# EAGLE design Qwiic RFID - IDXXLA (EAGLE 9.1.0)
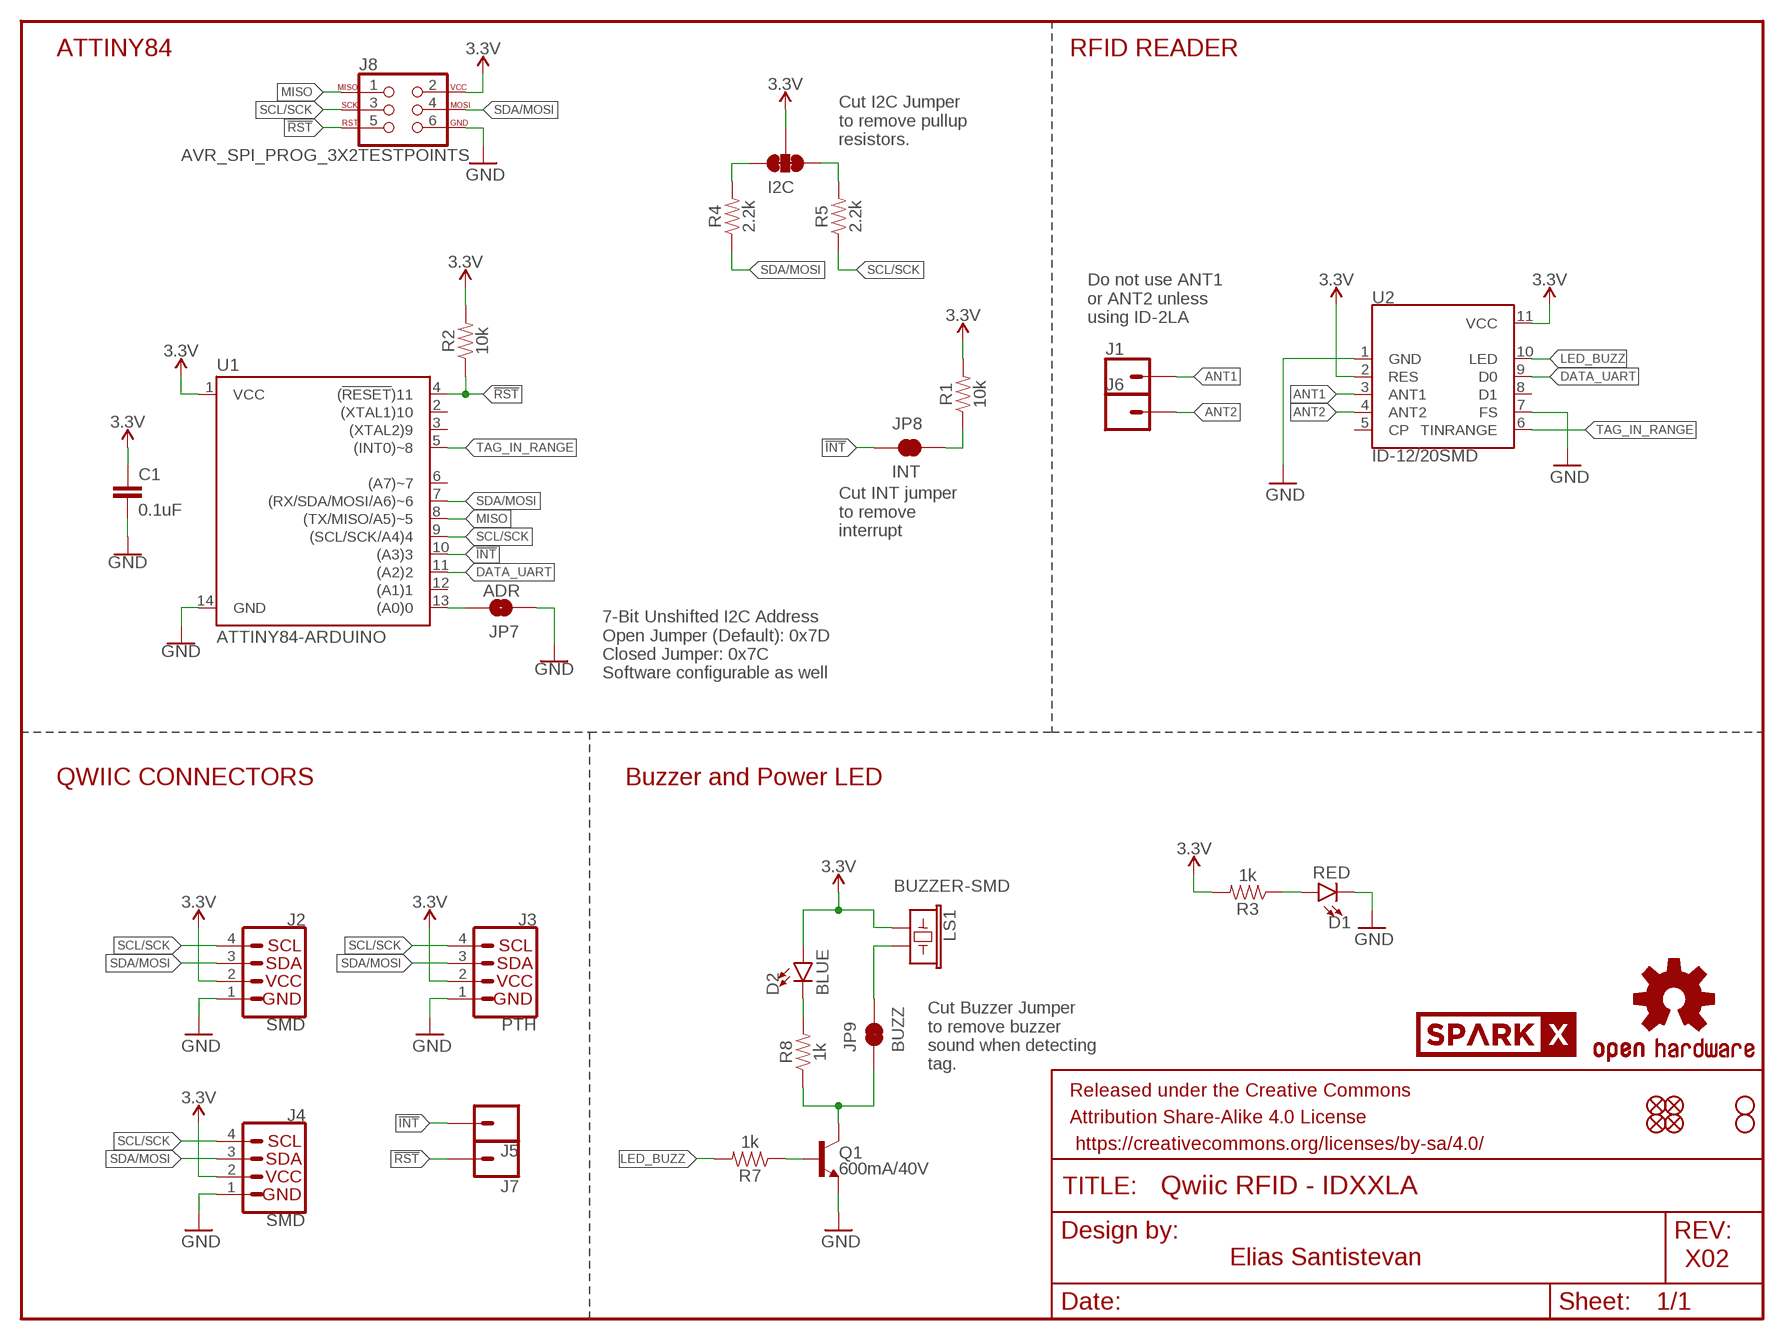
[diagram p0: schematic, sheet 1]

## Parts
C1  0.1uF  0.1UF-0603-25V-(+80/-20%)  [0603]
D1  RED  LED-RED0603  [LED-0603]
D2  BLUE  LED-BLUE0603  [LED-0603]
FRAME1  FRAME-LETTER  [CREATIVE_COMMONS]
I2C  JUMPER-SMT_3_2-NC_TRACE_SILK  [SMT-JUMPER_3_2-NC_TRACE_SILK]
J1  CONN_01PTH_NO_SILK_YES_STOP  [1X01_NO_SILK]
J2  SMD  I2C_STANDARDJS-1MM  [1X04_1MM_RA]
J3  PTH  I2C_STANDARD_NO_SILK  [1X04_NO_SILK]
J4  SMD  I2C_STANDARDJS-1MM  [1X04_1MM_RA]
J5  CONN_01PTH_NO_SILK_YES_STOP  [1X01_NO_SILK]
J6  CONN_01PTH_NO_SILK_YES_STOP  [1X01_NO_SILK]
J7  CONN_01PTH_NO_SILK_YES_STOP  [1X01_NO_SILK]
J8  AVR_SPI_PROG_3X2TESTPOINTS  [2X3_TEST_POINTS]
JP1  FIDUCIALUFIDUCIAL  [MICRO-FIDUCIAL]
JP2  FIDUCIALUFIDUCIAL  [MICRO-FIDUCIAL]
JP3  STAND-OFF  [STAND-OFF]
JP4  STAND-OFF  [STAND-OFF]
JP5  FIDUCIALUFIDUCIAL  [MICRO-FIDUCIAL]
JP6  FIDUCIALUFIDUCIAL  [MICRO-FIDUCIAL]
JP7  ADR  JUMPER-SMT_2_NO_SILK  [SMT-JUMPER_2_NO_SILK]
JP8  INT  JUMPER-SMT_2_NC_TRACE_SILK  [SMT-JUMPER_2_NC_TRACE_SILK]
JP9  BUZZ  JUMPER-SMT_2_NC_TRACE_SILK  [SMT-JUMPER_2_NC_TRACE_SILK]
LOGO1  OSHW-LOGOMINI  [OSHW-LOGO-MINI]
LS1  BUZZER-SMD  [BUZZER-CCV]
Q1  600mA/40V  TRANS_NPN-MMBT2222AL  [SOT23-3]
R1  10k  10KOHM-0603-1/10W-1%  [0603]
R2  10k  10KOHM-0603-1/10W-1%  [0603]
R3  1k  1KOHM-0603-1/10W-1%  [0603]
R4  2.2k  2.2KOHM-0603-1/10W-1%  [0603]
R5  2.2k  2.2KOHM-0603-1/10W-1%  [0603]
R7  1k  1KOHM-0603-1/10W-1%  [0603]
R8  1k  1KOHM-0603-1/10W-1%  [0603]
U1  ATTINY84-ARDUINO  [SO14]
U2  ID-12/20SMD  [ID-12_SMD]
U$4  SPARKX-LOGO3  [SPARKX-SMALL]

## Nets
3.3V: C1.1 D2.A I2C.2 J2.2(VCC) J3.2(VCC) J4.2(VCC) J8.2 LS1.+ R1.2 R2.2 R3.2 U1.1(VCC) U2.2(RES) U2.11(VCC)
!INT: J5.1 JP8.1 U1.10((A3)3)
!RST: J7.1 J8.5 R2.1 U1.4((!RESET!)11)
ANT1: J1.1 U2.3(ANT1)
ANT2: J6.1 U2.4(ANT2)
DATA_UART: U1.11((A2)2) U2.9(D0)
GND: C1.2 D1.C J2.1(GND) J3.1(GND) J4.1(GND) J8.6 JP7.1 Q1.2(E) U1.14(GND) U2.1(GND) U2.7(FS)
LED_BUZZ: R7.2 U2.10(LED)
MISO: J8.1 U1.8((TX/MISO/A5)~5)
N$1: I2C.1 R5.2
N$2: I2C.3 R4.2
N$3: D1.A R3.1
N$4: JP8.2 R1.1
N$5: D2.C R8.2
N$6: JP7.2 U1.13((A0)0)
N$7: Q1.1(B) R7.1
N$8: JP9.1 Q1.3(C) R8.1
N$9: JP9.2 LS1.-
SCL/SCK: J2.4(SCL) J3.4(SCL) J4.4(SCL) J8.3 R5.1 U1.9((SCL/SCK/A4)4)
SDA/MOSI: J2.3(SDA) J3.3(SDA) J4.3(SDA) J8.4 R4.1 U1.7((RX/SDA/MOSI/A6)~6)
TAG_IN_RANGE: U1.5((INT0)~8) U2.6(TINRANGE)
Unconnected: U1.2((XTAL1)10) U1.3((XTAL2)9) U1.6((A7)~7) U1.12((A1)1) U2.5(CP) U2.8(D1)

## Notes on the sheet
- ATTINY84 | RFID READER
- Cut I2C Jumper
  to remove pullup 
  resistors.
- Do not use ANT1 
  or ANT2 unless 
  using ID-2LA
- Cut INT jumper
  to remove 
  interrupt
- 7-Bit Unshifted I2C Address
  Open Jumper (Default): 0x7D
  Closed Jumper: 0x7C
  Software configurable as well
- QWIIC CONNECTORS | Buzzer and Power LED
- Cut Buzzer Jumper 
  to remove buzzer
  sound when detecting 
  tag.
- Elias Santistevan | X02

## Library data of the parts
C1 = SparkFun-Capacitors:0.1UF: 0.1µF ceramic capacitors A capacitor is a passive two-terminal electrical component used to store electrical energy temporarily in an electric field.; PROD_ID: CAP-00810
D1 = SparkFun-LED:LED-RED: Red SMD LED Used in manufacturing of most products at SparkFun Packages: 0603 - SMD 0603 package [Product Link] <http://docs.avagotech.com/docs/AV02-0551EN> 0603 SMART - SMD 0603 SMART package ( more efficient and expensive)[Product Link] <http://www.osram-os.com/Graphics/XPic2/00077099_0.pdf> 1206 - SMD1206 package [Product Link] <https://www.sparkfun.com/datasheets/DevTools/LilyPad/Q150OVS4.pdff> SparkFun Products: Pro Mini 328 -5V <https://www.sparkfun.com/products/821> RedBoard <https://www.sparkfun.com/products/12757> IOIO-OTG <https://www.sparkfun.com/products/13613>; PROD_ID: DIO-00819
D2 = SparkFun-LED:LED-BLUE: Blue SMD LED Used in manufacturing of various products at SparkFun Packages: 0603 - SMD 0603 package [Product Link] <http://www.digikey.com/product-detail/en/SMLE12BC7TT86/511-1589-2-ND/1641808> 1206 - SMD1206 package [Product Link] <http://www.digikey.com/product-detail/en/lite-on-inc/LTST-C150TBKT/160-1643-1-ND/573584> SparkFun Products: ESP8266 Thing-Dev Board <https://www.sparkfun.com/products/13711> RedBoard <https://www.sparkfun.com/products/12757>; PROD_ID: DIO-08575
FRAME1 = SparkFun-Aesthetics:FRAME-LETTER: Schematic Frame - Letter Standard 8.5x11 US Letter frame
I2C = SparkFun-Jumpers:JUMPER-SMT_3_2-NC_TRACE: Normally closed trace jumper (2 of 2 connections) This jumper has a trace between all three pads so they are normally closed (NC). Use a razor knife to open the connection(s). For best results follow the IPC guidelines for cutting traces: Cutout at least 0.063 mm (0.005 in). Remove all loose material to clean up the cut area. Seal the cut with an approved epoxy. Reapply solder to reclose the connection(s).
J1 J5-J7 = SparkFun-Connectors:CONN_01: Single connection point. Often used as Generic Header-pin footprint for 0.1 inch spaced/style header connections On any of the 0.1 inch spaced packages, you can populate with these: Break Away Headers - Straight <https://www.sparkfun.com/products/116> (PRT-00116) Break Away Male Headers - Right Angle <https://www.sparkfun.com/products/553> (PRT-00553) Female Headers <https://www.sparkfun.com/products/115> (PRT-00115) Break Away Headers - Machine Pin <https://www.sparkfun.com/products/117> (PRT-00117) Break Away Female Headers - Swiss Machine Pin <https://www.sparkfun.com/products/743> (PRT-00743) This device is also useful as a general connection point to wire up your design to another part of your project. Our various solder wires solder well into these plated through hole pads. Hook-Up Wire - Assortment (Stranded, 22 AWG) <https://www.sparkfun.com/products/11375> (PRT-11375) Hook-Up Wire - Assortment (Solid Core, 22 AWG) <https://www.sparkfun.com/products/11367> (PRT-11367) View the entire wire category on our website here <https://www.sparkfun.com/categories/141> Special notes: SMTSO-256-ET is a "flush mount" nut for a 4-40 screw. We mostly use this on specialty testbeds; it is a nice way to connect hardware to your PCB at an adjustable hieght. Also note, the SNAP packages are for using a snappable style connector. We sell a baggie of snaps and they are also used on two LilyPad designs: Snap Assortment - 30 pack (male and female) <https://www.sparkfun.com/products/11347> (DEV-11347) LilyPad Arduino SimpleSnap <https://www.sparkfun.com/products/10941> (DEV-10941) LilyPad SimpleSnap Protoboard <https://www.sparkfun.com/products/10940> (DEV-10940)
J2-J4 = SparkX:I2C_STANDARD: SparkFun I2C Standard Pinout Header SparkFun has standardized on a pinout for all I2C based sensor breakouts. This pinout allows I2C boards to be plugged directly into the headers on Arduino Uno compatible boards, and to be daisy chained easily. Example SparkFun Products: SparkFun Atmospheric Sensor Breakout - BME280 <https://www.sparkfun.com/products/13676> SparkFun Altitude/Pressure Sensor Breakout - MPL3115A2 <https://www.sparkfun.com/products/11084> SparkFun TOF Range Finder Sensor - VL6180 <https://www.sparkfun.com/products/12785>
J8 = SparkFun-Connectors:AVR_SPI_PROG_3X2: AVR ISP 6 Pin This is the reduced ISP connector for AVR programming. Common on Arduino. This footprint will take up less PCB space and can be used with a 10-pin to 6-pin adapter such as SKU: BOB-08508 **Special note about "TEST_POINT" package. The stop mask is on the top side, so if you want your programming test points to be on the bottom of your board, make sure to place this package on the bottom side of the board. This also ensure that the orientation to program from the bottom side will be correct. SparkFun Products: SparkFun ISP Pogo Adapter <https://www.sparkfun.com/products/11591> - NS Tiny AVR Programmer <https://www.sparkfun.com/products/11801> -PTH
JP1 JP2 JP5 JP6 = SparkFun:FIDUCIAL: Fiducial Alignment Points Various fiducial points for machine vision alignment.
JP3 JP4 = SparkFun:STAND-OFF: Stand Off This is the mechanical footprint for a #4 phillips button head screw. Use the keepout ring to avoid running the screw head into surrounding components. SKU : PRT-00447
JP7 = SparkFun-Jumpers:JUMPER-SMT_2_NO: Normally open jumper This jumper has two pads in close proximity to each other. Apply solder to close the connection. Round pads are easier to solder for beginners, but are a lot larger. SparkFun Product that uses the round pads: SparkFun EL Sequencer <https://www.sparkfun.com/products/12781>
JP8 JP9 = SparkFun-Jumpers:JUMPER-SMT_2_NC_TRACE: Normally closed trace jumper This jumper has a trace between two pads so it's normally closed (NC). Use a razor knife to open the connection. For best results follow the IPC guidelines for cutting traces: Cutout at least 0.063 mm (0.005 in). Remove all loose material to clean up the cut area. Seal the cut with an approved epoxy. Reapply solder to reclose the connection.
LOGO1 = SparkFun-Aesthetics:OSHW-LOGO: Open-Source Hardware (OSHW) Logo This logo indicates the piece of hardware it is found on incorporates a OSHW license and/or adheres to the definition of open source hardware found here: http://freedomdefined.org/OSHW
LS1 = SparkFun-Electromechanical:BUZZER: Buzzer Small round buzzers that operate around the audible 2kHz range. You can use these as speakers to create simple music or user interfaces. Variant Overview: PTH - Mini Speaker - PC Mount 12mm 2.048kHz <https://www.sparkfun.com/products/7950> PTH_KIT - Mini Speaker - PC Mount 12mm 2.048kHz <https://www.sparkfun.com/products/7950> KIT simplifies soldering by adding stop mask to one side of the pads. PTH_NO_SILK - Mini Speaker - PC Mount 12mm 2.048kHz <https://www.sparkfun.com/products/7950> No silkscreen indicator of buzzer outline. PTH_KIT_NO_SILK - Mini Speaker - PC Mount 12mm 2.048kHz <https://www.sparkfun.com/products/7950> KIT package w/o silkscreen SMD - Buzzer Audio Magnetic (CCV-084B16) SMD buzzer used on, e.g. the LilyPad Buzzer <https://www.sparkfun.com/products/8463> and RFID USB Reader <https://www.sparkfun.com/products/9963>. SMD_KIT - Buzzer Audio Magnetic (CCV-084B16) SMD Buzzer with elongated pins to make soldering easier. Used on the SparkFun Simon Says - Surface Mount Soldering Kit <https://www.sparkfun.com/products/10935>.; PROD_ID: COMP-08568
Q1 = SparkFun-DiscreteSemi:TRANS_NPN: NPN transistor Current controlled devices typically used to amplify current or used as a switch. BC547 - COM-08928 <http://www.sparkfun.com/products/8928> (TO-92 45V 100mA) (1.Collector 2.Base 3.Emitter) 2N3904 - COM-00521 <http://www.sparkfun.com/products/521> (TO-92 40V 200mA) (1.Emitter 2.Base 3.Collector) P2N2222A - COM-12852 <http://www.sparkfun.com/products/12852> (TO-92 40V 600mA) (1.Collector 2.Base 3.Emitter); PROD_ID: TRANS-08049
R1 R2 = SparkFun-Resistors:10KOHM: 10kΩ resistor A resistor is a passive two-terminal electrical component that implements electrical resistance as a circuit element. Resistors act to reduce current flow, and, at the same time, act to lower voltage levels within circuits. - Wikipedia; PROD_ID: RES-00824
R3 R7 R8 = SparkFun-Resistors:1KOHM: 1kΩ resistor A resistor is a passive two-terminal electrical component that implements electrical resistance as a circuit element. Resistors act to reduce current flow, and, at the same time, act to lower voltage levels within circuits. - Wikipedia; PROD_ID: RES-07856
R4 R5 = SparkFun-Resistors:2.2KOHM: 2.2kΩ resistor A resistor is a passive two-terminal electrical component that implements electrical resistance as a circuit element. Resistors act to reduce current flow, and, at the same time, act to lower voltage levels within circuits. - Wikipedia; PROD_ID: RES-08272
U1 = SparkFun-IC-Microcontroller:ATTINY84-ARDUINO; PROD_ID: IC-11285
U2 = SparkFun-RF:ID-12/20: ID Innovations 125kHz RFID Reader (ID2, ID3, ID12, and ID20) The IDS, ID3, ID12, and ID20 are very simple to use RFID reader modules. Power the module, hold up a 125kHz card, and get a serial string output containing the unique ID of the card. SparkFun Products RFID Reader ID-3LA (125 kHz) <https://www.sparkfun.com/products/11862> (SEN-11862) RFID Reader ID-12LA (125 kHz) <https://www.sparkfun.com/products/11827> (SEN-11827) RFID Reader ID-20LA (125 kHz) <https://www.sparkfun.com/products/11828> (SEN-11828) SparkFun RFID USB Reader <https://www.sparkfun.com/products/9963> (SEN-9963); PROD_ID: CONN-09345, CONN-09344
U$4 = SparkX:SPARKX-LOGO

## Net classes
1 power: width 0.203 mm

## Board
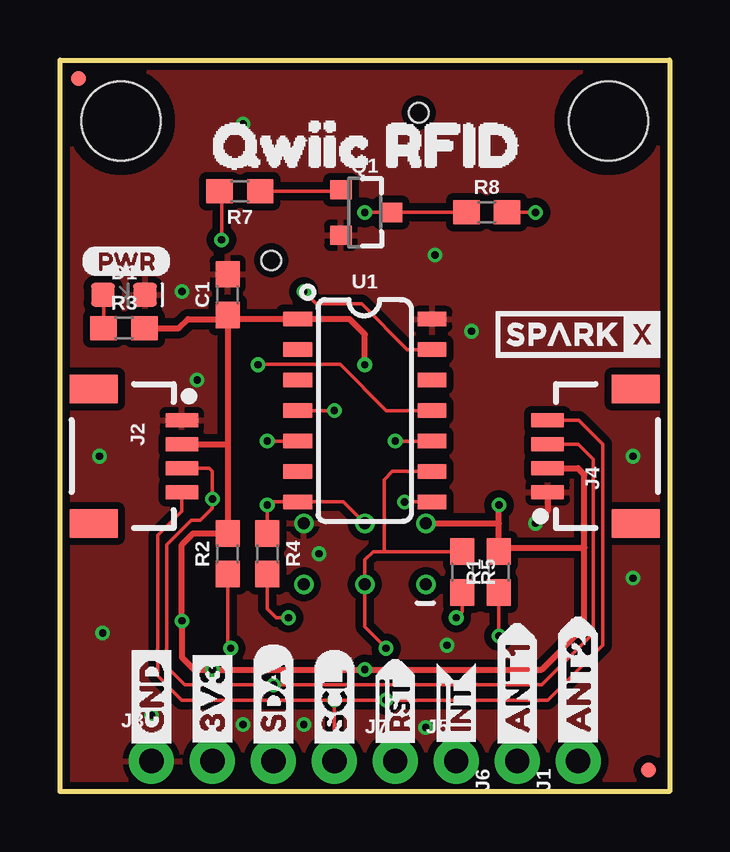
[diagram p1: board, top side]
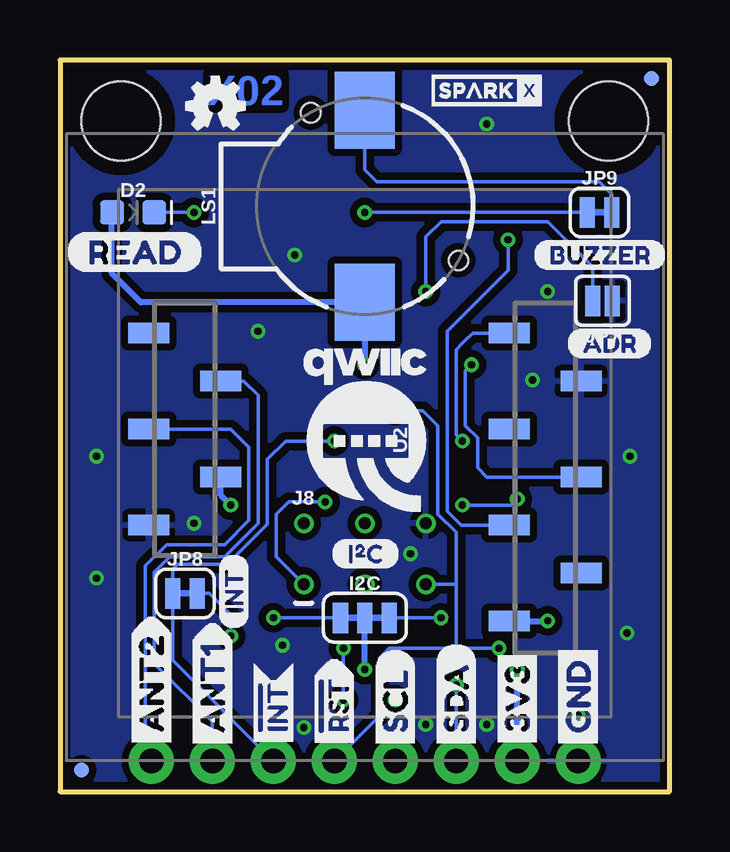
[diagram p2: board, bottom side, seen from below]

Size 25.4 x 30.48 mm. Coordinates in mm from the lower left corner, seen from the top.
Outline: 0,0 0,30.48 25.4,30.48 25.4,0 0,0
Copper layers (1*16): Top 0.035mm / dielectric 1.5mm / Bottom 0.035mm
Design rules "SparkFun-2-layer-PCBWay-LIMIT": minimum track width 6mil, minimum drill 0.3mm, track to track 6mil, track to pad 6mil, pad to pad 6mil, via to via 6mil, smd to smd 6mil, copper to edge 6mil, drill to drill 6mil, minimum pad ring 6mil, minimum via ring 6mil, stop-mask expansion 4mil, vias tented up to drill 25mil, thermal gap 10mil

### Footprints (pad centres in the part's own frame; a part is rotated, then mirrored left to right if it is on the bottom)
0603 = smd 1.1 x 1: 1 -0.85,0; 2 0.85,0
LED-0603 = smd 1 x 1: A -0.877,0; C 0.877,0
SMT-JUMPER_3_2-NC_TRACE_SILK = smd 0.635 x 1.27: 1 -1.016,0; 2 0,0; 3 1.016,0
1X01_NO_SILK = drill 1.016 pad 1.88: 1 0,0
1X04_1MM_RA = smd 0.6 x 1.35: 1 -1.5,0; 2 -0.5,0; 3 0.5,0; 4 1.5,0 | smd 1.2 x 2: NC1 2.8,-3.675; NC2 -2.8,-3.675
1X04_NO_SILK = drill 1.016 pad 1.88: 1 0,0; 2 2.54,0; 3 5.08,0; 4 7.62,0
2X3_TEST_POINTS = drill 0.508: 1 -2.54,-1.27; 2 -2.54,1.27; 3 0,-1.27; 4 0,1.27; 5 2.54,-1.27; 6 2.54,1.27
MICRO-FIDUCIAL = smd 0.635 x 0.635: 1 0,0
STAND-OFF = hole 3.302: 0,0
SMT-JUMPER_2_NO_SILK = smd 0.635 x 1.27: 1 -0.406,0; 2 0.406,0
SMT-JUMPER_2_NC_TRACE_SILK = smd 0.635 x 1.27: 1 -0.508,0; 2 0.508,0
BUZZER-CCV = smd 3.2 x 2.5: + 4,0; - -4,0 | hole 0.8: -3.9,-2.25; 2.25,3.9
SOT23-3 = smd 0.8 x 0.9: 1 -0.95,-1; 2 0.95,-1; 3 0,1.1
SO14 = smd 0.6 x 1.2: 1 -3.175,-2.8; 2 -1.905,-2.8; 3 -0.635,-2.8; 4 0.635,-2.8; 5 1.905,-2.8; 6 3.175,-2.8; 7 4.445,-2.8; 8 4.445,2.8; 9 3.175,2.8; 10 1.905,2.8; 11 0.635,2.8; 12 -0.635,2.8; 13 -1.905,2.8; 14 -3.175,2.8
ID-12_SMD = smd 0.85 x 1.7: 1 2.993,-8.998; 2 0.993,-5.998; 3 -1.007,-8.998; 4 -3.007,-5.998; 5 -5.007,-8.998; 6 -5.007,6.013; 7 -3.007,9.013; 8 -1.007,6.013; 9 0.993,9.013; 10 2.993,6.013; 11 6.993,6.013; NC 4.993,9.013

### Placement (x,y rotation side)
C1  6.99,20.7 90 top
D1  2.67,20.7 0 top
D2  22.35,24.13 0 bottom
FRAME1  -8.89,-10.16 0 top  (outside the outline)
I2C  12.7,7.24 0 bottom
J1  21.59,1.27 90 top
J2  5.08,13.97 270 top
J3  3.81,1.27 0 top
J4  20.32,13.97 90 top
J5  16.51,1.27 0 top
J6  19.05,1.27 90 top
J7  13.97,1.27 0 top
J8  12.7,9.91 0 bottom
JP1  0.76,29.72 0 bottom
JP2  24.51,0.89 0 top
JP3  2.54,27.94 0 top
JP4  22.86,27.94 0 top
JP5  24.51,0.89 0 bottom
JP6  0.76,29.72 0 top
JP7  2.79,20.45 180 bottom
JP8  20.19,8.26 0 bottom
JP9  2.92,24.13 0 bottom
LOGO1  18.92,28.57 0 bottom
LS1  12.7,24.38 270 bottom
Q1  12.7,24.13 270 top
R1  18.29,9.14 90 top
R2  6.99,9.91 90 top
R3  2.67,19.3 0 top
R4  8.64,9.91 270 top
R5  16.76,9.14 270 top
R7  7.49,25.02 180 top
R8  17.78,24.13 0 top
U1  12.7,16.51 270 top
U2  12.7,14.1 270 bottom
U$1  [SPARKX-TINY]  7.62,29.21 0 bottom
U$2  [I_SUPER2_C-()-03]  14.1,9.91 0 bottom
U$3  [ANT20]  21.59,1.52 90 bottom
U$4  21.59,19.05 0 top
U$5  [RST#-[>]  13.97,1.4 90 top
U$6  [SDA-[)]  8.89,1.52 90 top
U$7  [SCL-[)]  11.43,1.52 90 top
U$8  [QWIIC-LOGO-MEDIUM]  12.7,15.11 0 bottom
U$9  [GND-04]  3.81,1.52 90 top
U$10  [3V3-04]  6.35,1.52 90 top
U$11  [INT#-[<]  16.51,1.4 90 top
U$12  [ADR0]  4.32,18.67 0 bottom
U$13  [INT0]  18.16,6.73 90 bottom
U$14  [PWR-()-03]  0.89,22.1 0 top
U$15  [BUZZER0]  5.71,22.35 0 bottom
U$16  [ANT10]  19.05,1.52 90 top
U$17  [ANT20]  21.59,1.52 90 top
U$18  [READ0]  25.15,22.48 0 bottom
U$19  [QWIIC_RFID0]  4.7,26.92 0 top
U$20  [ANT10]  19.05,1.52 90 bottom
U$21  [INT#-[<]  16.51,1.4 90 bottom
U$22  [SCL-[)]  11.43,1.52 90 bottom
U$23  [SDA-[)]  8.89,1.52 90 bottom
U$24  [3V3-04]  6.35,1.52 90 bottom
U$25  [GND-04]  3.81,1.52 90 bottom
U$26  [RST#-[>]  13.97,1.4 90 bottom

### Tracks (layer width: path | path; a pad name or v marks a point on that pad's centre or on a via)
3.3V  (via drill 0.3)
  Top 0.254: v12.7,17.78 12.7,19.05 12.06,19.68 U1.1 7.15,19.68 C1.1 6.99,19.68 | J4.2 21.58,13.47 21.84,13.21 21.84,10.16 | 21.84,10.16 21.84,6.86 20.07,5.08 v12.7,5.08 v6.35,5.08 5.59,5.08 5.08,5.59 v5.08,7.11 5.08,10.29 5.55,10.76 R2.2 6.99,14.48 | R3.2 4.95,19.3 5.33,19.68 6.99,19.68 | 6.99,19.68 6.99,14.48 | J2.2 6.98,14.47 6.99,14.48 | 21.84,10.16 18.45,10.16 R1.2 18.29,11.18 | 18.29,11.18 v18.29,11.94 | J8.2 18.29,11.18
  Bottom 0.254: U2.11 v5.09,7.1 v5.08,7.11 | v12.7,17.78 LS1.+ 22.04,20.38 23.24,21.59 23.24,24.12 D2.A | v12.7,5.08 I2C.2 | J3.2 v6.35,5.08 | v18.29,11.94 18.7,12.35 U2.2
!INT  (via drill 0.3)
  Top 0.152: v13.97,14.61 U1.10
  Bottom 0.152: J5.1 20.7,5.46 JP8.1 20.7,9.27 20.5,9.47 18.42,9.47 17.75,10.13 16.76,11.13 16.76,13.84 16,14.61 v13.97,14.61
!RST  (via drill 0.3)
  Top 0.152: U1.4 v11.43,15.88 | R2.1 6.99,6.1 v7.11,5.97
  Bottom 0.152: J7.1 12.06,3.17 12.06,5.59 11.68,5.97 8.89,5.97 | 8.89,5.97 v7.11,5.97 | v11.43,15.88 10.29,15.88 9.65,15.24 9.65,11.56 8.89,10.79 8.89,8.64 | 8.89,5.97 8.89,8.64 | J8.5 8.89,8.64
ANT1
  Bottom 0.152: U2.3 18.28,15.1 17.53,14.35 17.53,11.3 18.54,10.29 20.95,10.29 21.84,9.4 21.84,1.52 J1.1
ANT2
  Bottom 0.152: U2.4 17.74,17.1 17.14,16.51 17.14,11.18 18.54,9.78 20.83,9.78 21.46,9.14 21.46,5.33 19.05,2.92 J6.1
DATA_UART  (via drill 0.3)
  Top 0.152: U1.11 13.6,15.88 11.67,17.8 8.28,17.8 v8.26,17.78
  Bottom 0.152: U2.9 7.62,13.1 8,13.48 8,14.73 8.51,15.24 8.51,17.53 v8.26,17.78
GND  (via drill 0.3)
  Top 0.254: J4.1 20.32,11.68 v19.81,11.18
  other vias: 23.88,8.89 7.62,27.81 5.08,20.83 5.71,17.14 16.13,6.1 15.62,22.35 17.14,19.18 23.88,13.97 3.81,3.17 10.79,9.91 1.78,6.6 1.65,13.97 10.16,2.79 7.62,2.79 15.24,2.67
  pour Bottom (isolate 0.305): 0,0 0,30.48 25.4,30.48 25.4,0
  pour Top (isolate 0.305): 0,0 0,30.48 25.4,30.48 25.4,0
LED_BUZZ  (via drill 0.3)
  Top 0.152: R7.2 6.48,24.85 6.73,24.6 v6.73,22.99
  Bottom 0.152: U2.10 8.69,11.1 9.27,11.68 9.27,19.18 6.73,21.72 v6.73,22.99
MISO  (via drill 0.3)
  Top 0.152: v14.35,12.06 U1.8
  Bottom 0.152: J8.1 16.38,9.78 16.38,11.56 15.88,12.06 v14.35,12.06
N$1  (via drill 0.3)
  Top 0.152: R5.2 16.76,7.49 v16.51,7.24
  Bottom 0.152: I2C.1 v16.51,7.24
N$2  (via drill 0.3)
  Top 0.152: R4.2 8.64,7.62 9.02,7.24 v9.53,7.24
  Bottom 0.152: v9.53,7.24 I2C.3
N$3
  Top 0.152: D1.A 1.82,20.67 R3.1
N$4  (via drill 0.3)
  Top 0.152: R1.1 v18.29,6.48
  Bottom 0.152: JP8.2 19.18,8.26 18.29,7.37 v18.29,6.48
N$5  (via drill 0.3)
  Top 0.152: v19.81,24.13 R8.2
  Bottom 0.152: v19.81,24.13 D2.C
N$6  (via drill 0.3)
  Top 0.152: U1.13 14.48,18.41 12.57,20.32 10.67,20.32 v10.16,20.83
  Bottom 0.152: JP7.2 3.2,21.87 5.08,23.75 9.53,23.75 10.16,23.11 v10.16,20.83
N$7
  Top 0.152: R7.1 11.64,25.02 Q1.1
N$8  (via drill 0.3)
  Top 0.152: v12.7,24.13 Q1.3 R8.1
  Bottom 0.152: v12.7,24.13 JP9.1
N$9
  Bottom 0.152: JP9.2 2.41,24.89 2.92,25.4 12.19,25.4 12.7,25.91 LS1.-
SCL/SCK  (via drill 0.3)
  Top 0.152: U1.9 13.84,13.34 13.5,12.99 13.5,10.03 13.46,9.99 | J3.4 v11.43,3.81 | J4.4 21.61,15.47 22.61,14.48 22.61,6.1 20.32,3.81 v13.59,3.81 v11.43,3.81 | v11.43,3.81 5.08,3.81 4.06,4.83 4.06,10.67 5.08,11.68 J2.4 | v13.59,5.97 12.7,6.86 J8.3 12.7,9.65 13.04,9.99 13.46,9.99 | 13.46,9.99 R5.1
  Bottom 0.152: v13.59,5.97 v13.59,3.81
SDA/MOSI  (via drill 0.3)
  Top 0.152: J4.3 21.6,14.47 22.23,13.84 22.23,6.6 20.07,4.45 v8.89,4.45 5.21,4.45 4.45,5.21 4.45,10.29 5.46,11.3 5.84,11.3 6.35,11.81 v6.35,12.19 6.35,13.34 6.21,13.47 J2.3 | J8.4 11.81,12.06 U1.7 8.76,12.06 v8.64,11.94 R4.1
  Bottom 0.152: J3.3 v8.89,4.45 | v8.64,11.94 6.6,11.94 v6.35,12.19
TAG_IN_RANGE  (via drill 0.3)
  Top 0.152: v8.64,14.61 U1.5
  Bottom 0.152: U2.6 8.2,19.1 8.57,18.73 8.64,18.67 8.89,18.41 8.89,14.86 v8.64,14.61

### Text on the board
Bottom: X02
Measures: Units in Inches
tDocu: Elias Santistevan